# EasyEDA schematic SCH_Victron-Orion-DC-DC-Charger-Cooling-Fan-Controller_2025-03-17.json
TITLE: Victron Orion DC-DC Charger Cooling Fan Controller; REV: 1.1; Date: 2025-03-17; Sheet: 1/1; Drawn By: daipie64
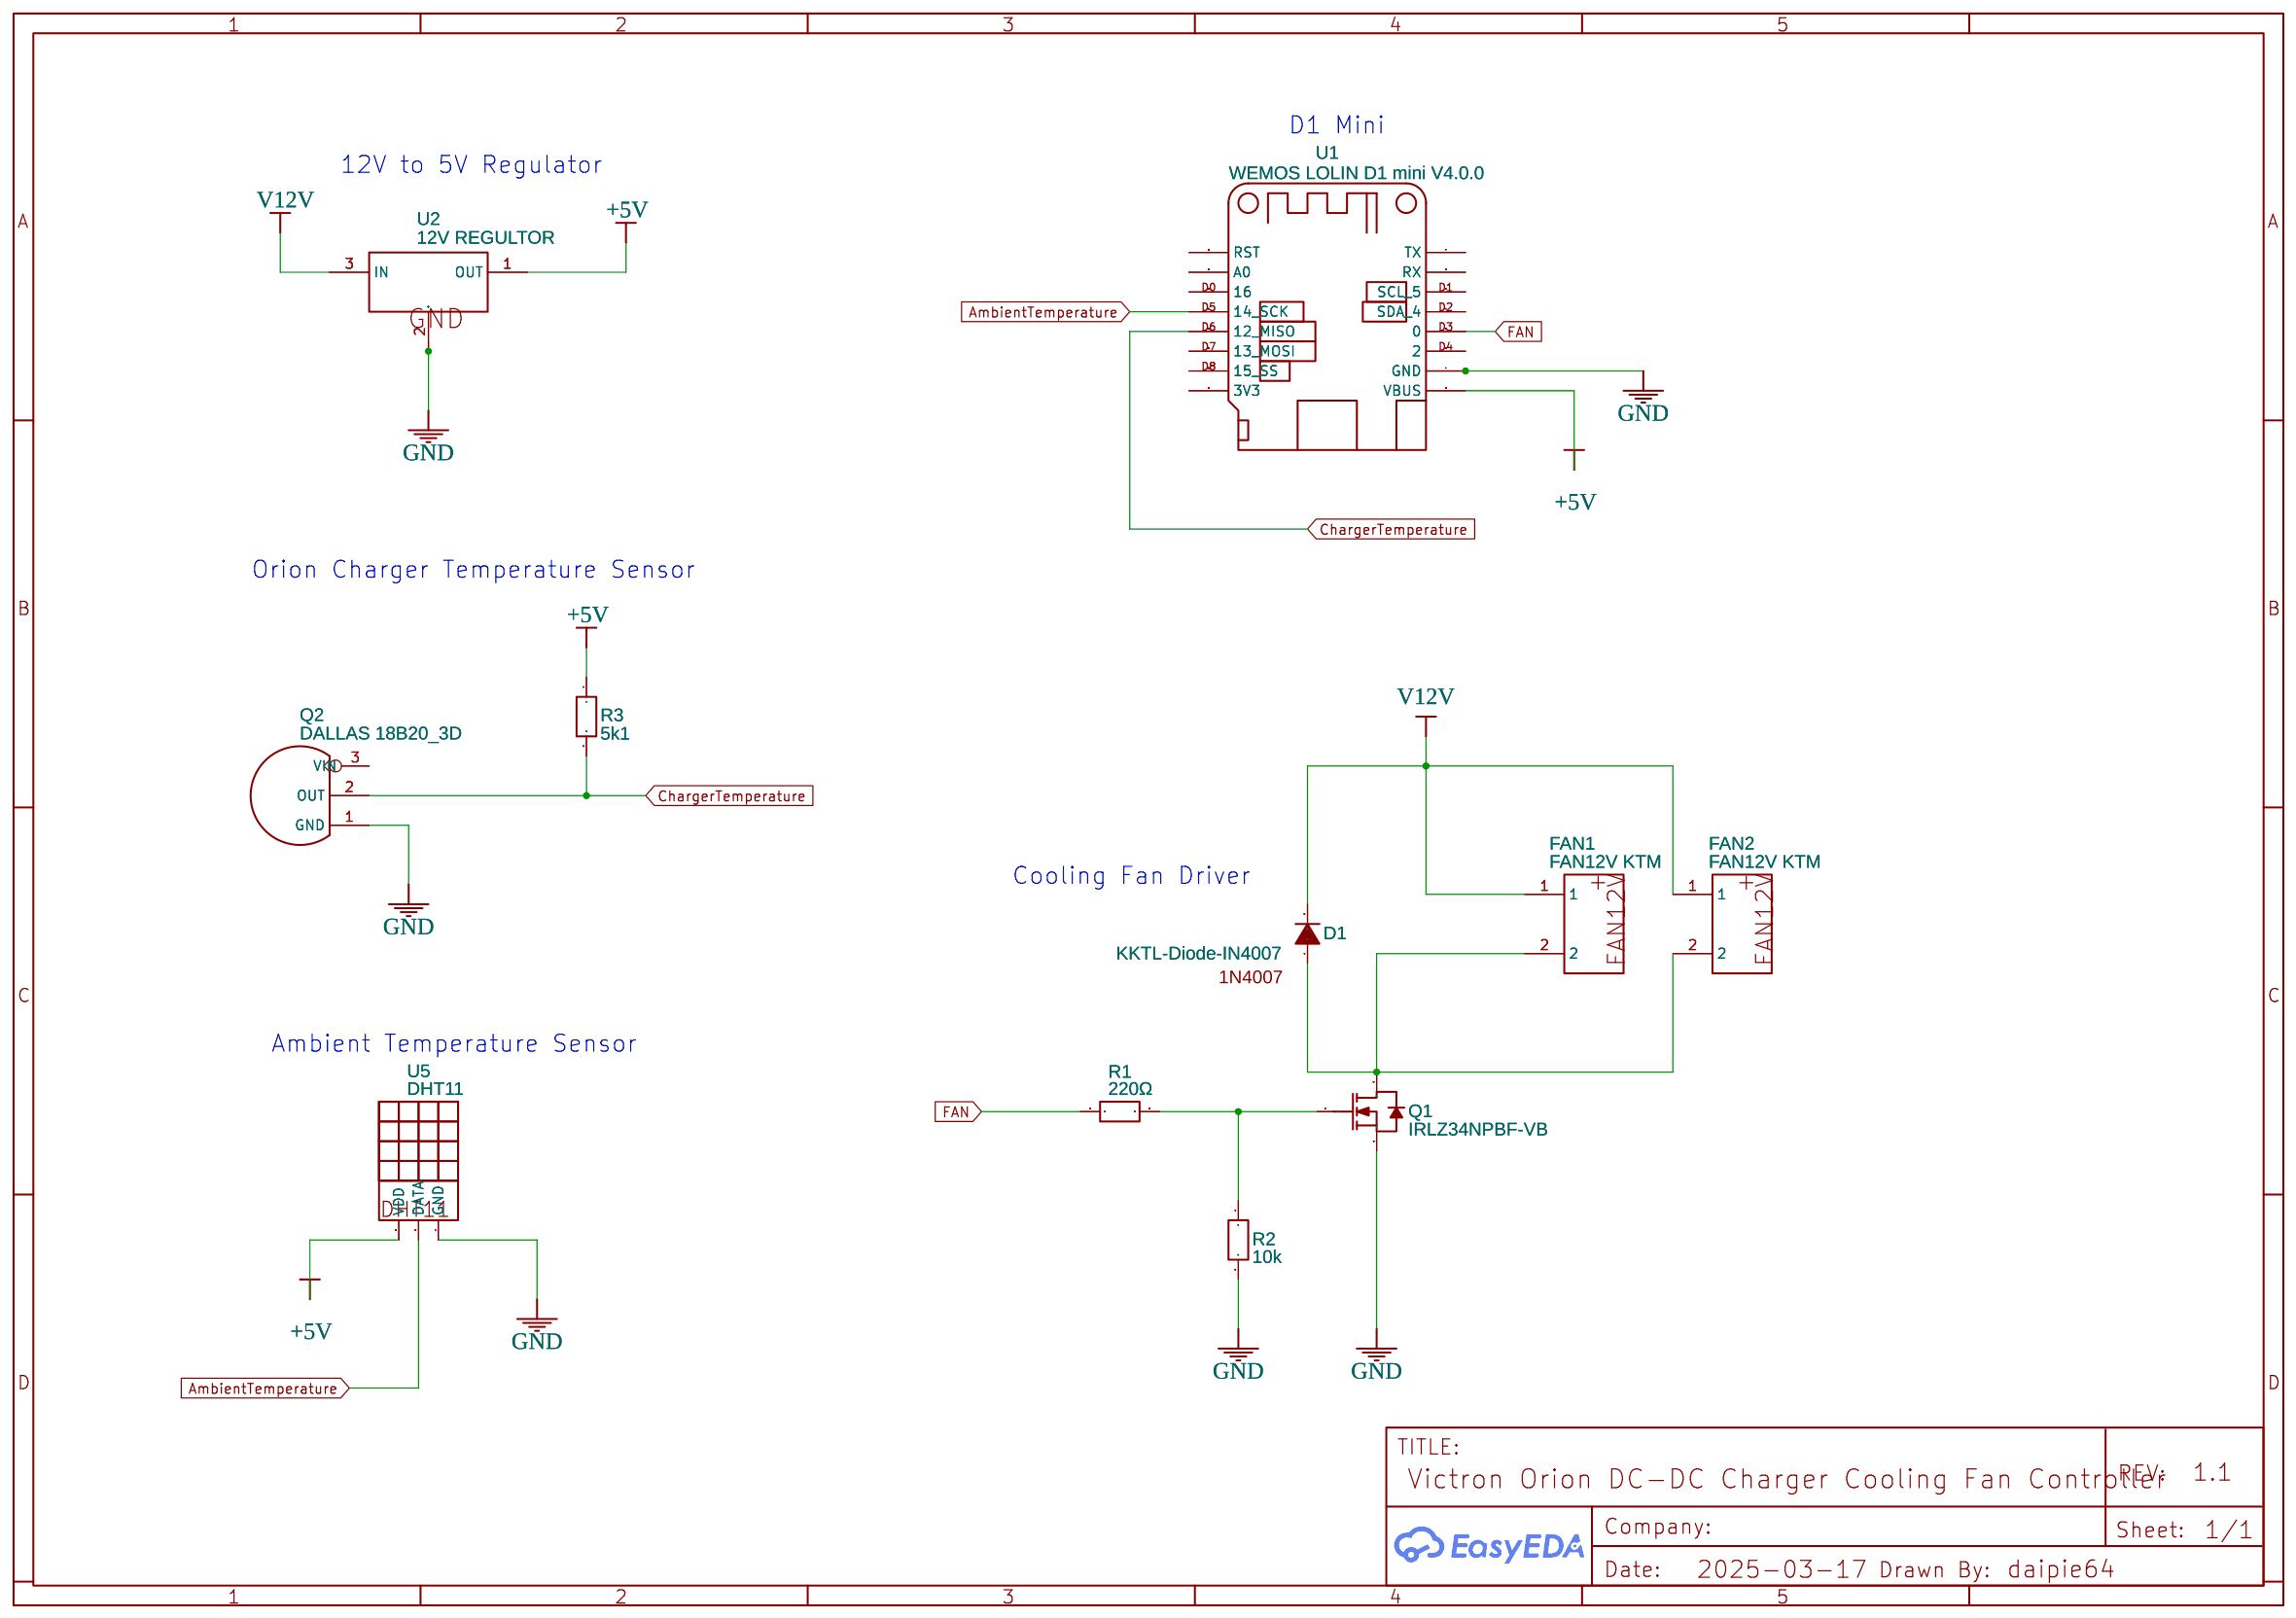
[diagram p0: schematic sheet]

## Parts
D1  KKTL-Diode-IN4007  [KKTL-DIODE-IN4007]
FAN1  FAN12V KTM  [FAN12V KTM]
FAN2  FAN12V KTM  [FAN12V KTM]
Q1  IRLZ34NPBF-VB  [TO-220AB-3_L10.4-W4.6-P2.54-L]
Q2  DALLAS 18B20_3D  [TO-92 AMMO]
R1  220Ω  [R0603]
R2  10k  [R0603]
R3  5k1  [R0603]
U1  WEMOS LOLIN D1 mini V4.0.0  [WEMOS LOLIN D1 MINI V4.0.0_FOOTPRINT]
U2  12V REGULTOR  [SOT-89-3_L4.5-W2.5-P1.50-LS4.2-BR]
U5  DHT11  [DHT11]

## Library data of the parts
D1 = KKTL-Diode-IN4007: Contributor: kakatuland
FAN1 FAN2 = FAN12V KTM: Manufacturer: ktm; Manufacturer Part: ktm; Supplier: ktm; Contributor: krzysiekI
Q1 = IRLZ34NPBF-VB: Contributor: lcsc; Supplier: LCSC; Supplier Part: C7429062; Manufacturer: VBsemi(微碧半导体)
Q2 = DALLAS 18B20_3D: Dallas 1-wire Temp Sensor; Supplier Part: 314010014; Supplier: SeeedStudio; Manufacturer Part: DS18B20
R1-R3 = R_0603_EU: Contributor: LCEDA_Lib
U1 = WEMOS LOLIN D1 mini V4.0.0: Contributor: codec_xyz
U2 = 7805(SOT-89): Supplier: LCSC; Manufacturer: CJ; Manufacturer Part: CJ78L05; image: //image.lceda.cn/szlcsc/C2079.jpg; Supplier Part: C2079; Paste Type: expand; Contributor: LCEDA_Lib
U5 = DHT11: DIP Tem-Hum Sensor; Supplier Part: 314010000; Supplier: SeeedStudio; Contributor: ismifaizul

## Nets
+5V: R3.1 U1.8(VBUS) U2.1(OUT) U5.3(VDD)
GND: Q1.3(S) Q2.1(GND) R2.2 U1.7(GND) U2.2(GND) U5.1(GND)
V12V: D1.2 FAN1.1 FAN2.1 U2.3(IN)
AmbientTemperature: U1.12(14 SCK) U5.2(DATA)
ChargerTemperature: Q2.2(OUT) R3.2 U1.13(12 MISO)
FAN: R1.1 U1.5(0)
Net-(D1-1): D1.1 FAN1.2 FAN2.2 Q1.2(D)
Net-(Q1-1): Q1.1(G) R1.2 R2.1

Not connected (* = marked no-connect by the designer): Q2 3(VIN); U1 1(TX) 2(RX) 3(SCL 5) 4(SDA 4) 6(2) 9(RST) 10(A0) 11(16) 14(13 MOSI) 15(15 SS) 16(3V3)

## Notes on the sheet
- D1 Mini
- 12V to 5V Regulator
- Orion Charger Temperature Sensor
- Cooling Fan Driver
- Ambient Temperature Sensor
